# EAGLE design main (EAGLE 6.5.0)
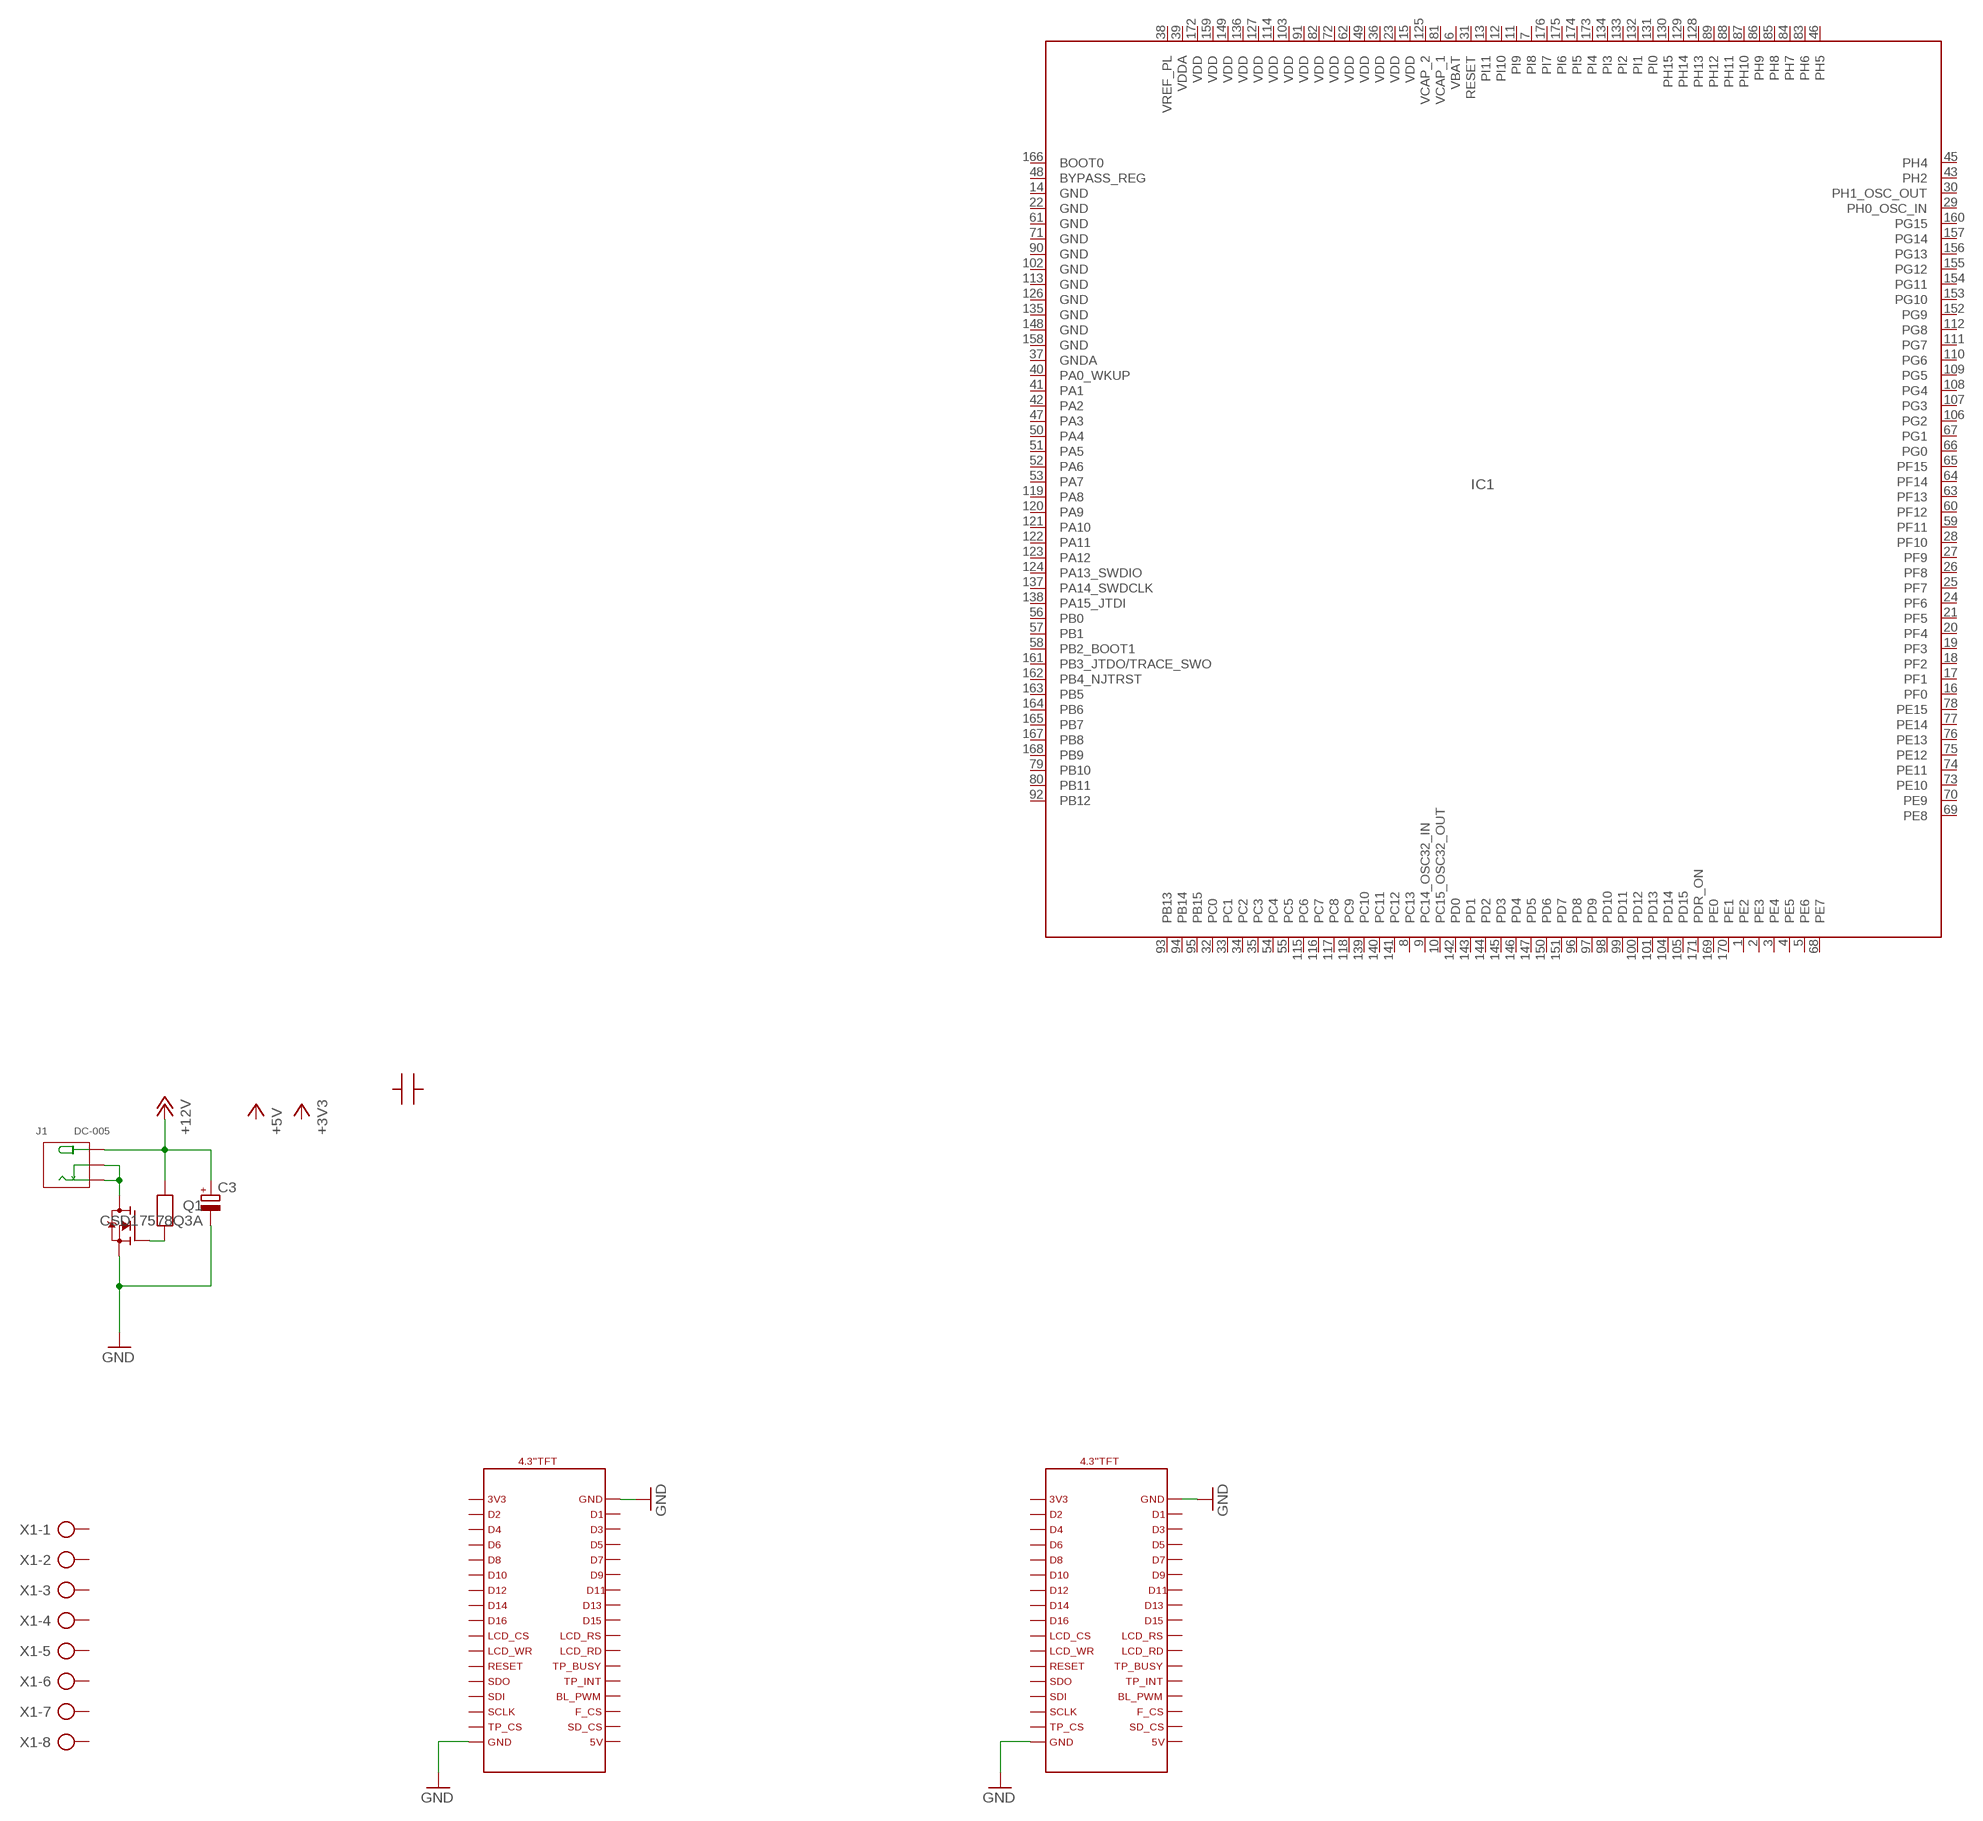
[diagram p0: schematic, sheet 1]

## Parts
C1  CAP0603  [C0603]
C3  CPOL-EU153CLV-0807  [153CLV-0807]
IC1  STM32F429IIT6  [LQFP176]
J1  DC-005  CONN-POWER-JACK-2.1MM(DC-005)  [DCJ3P-14.2X11.0X9.0MM]
Q1  CSD17578Q3A  [VSONP8]
R1  RES0603  [R0603]
U$1  4.3"TFT  [4.3TFT]
X1  AK500/8  [AK500/8]

## Nets
+12V: C3.+ J1.+ R1.1
GND: C3.- Q1.S1(S) Q1.S2(S) Q1.S3(S) U$1.JP1_1 U$1.JP1_34 U$1.JP2_1 U$1.JP2_34
N$1: Q1.G R1.2
N$2: J1.-1(-) J1.-2(CDN) Q1.D1(D) Q1.D2(D) Q1.D3(D) Q1.D4(D) Q1.D5(D)
Unconnected: C1.1 C1.2 IC1.1(PE2) IC1.2(PE3) IC1.3(PE4) IC1.4(PE5) IC1.5(PE6) IC1.7(PI8) IC1.8(PC13) IC1.9(PC14_OSC32_IN) IC1.10(PC15_OSC32_OUT) IC1.11(PI9) IC1.12(PI10) IC1.13(PI11) IC1.16(PF0) IC1.17(PF1) IC1.18(PF2) IC1.19(PF3) IC1.20(PF4) IC1.21(PF5) IC1.24(PF6) IC1.25(PF7) IC1.26(PF8) IC1.27(PF9) IC1.28(PF10) IC1.29(PH0_OSC_IN) IC1.30(PH1_OSC_OUT) IC1.31(RESET) IC1.32(PC0) IC1.33(PC1) IC1.34(PC2) IC1.35(PC3) IC1.40(PA0_WKUP) IC1.41(PA1) IC1.42(PA2) IC1.43(PH2) IC1.45(PH4) IC1.46(PH5) IC1.47(PA3) IC1.48(BYPASS_REG) IC1.50(PA4) IC1.51(PA5) IC1.52(PA6) IC1.53(PA7) IC1.54(PC4) IC1.55(PC5) IC1.56(PB0) IC1.57(PB1) IC1.58(PB2_BOOT1) IC1.59(PF11) IC1.60(PF12) IC1.63(PF13) IC1.64(PF14) IC1.65(PF15) IC1.66(PG0) IC1.67(PG1) IC1.68(PE7) IC1.69(PE8) IC1.70(PE9) IC1.73(PE10) IC1.74(PE11) IC1.75(PE12) IC1.76(PE13) IC1.77(PE14) IC1.78(PE15) IC1.79(PB10) IC1.80(PB11) IC1.83(PH6) IC1.84(PH7) IC1.85(PH8) IC1.86(PH9) IC1.87(PH10) IC1.88(PH11) IC1.89(PH12) IC1.92(PB12) IC1.93(PB13) IC1.94(PB14) IC1.95(PB15) IC1.96(PD8) IC1.97(PD9) IC1.98(PD10) IC1.99(PD11) IC1.100(PD12) IC1.101(PD13) IC1.104(PD14) IC1.105(PD15) IC1.106(PG2) IC1.107(PG3) IC1.108(PG4) IC1.109(PG5) IC1.110(PG6) IC1.111(PG7) IC1.112(PG8) IC1.115(PC6) IC1.116(PC7) IC1.117(PC8) IC1.118(PC9) IC1.119(PA8) IC1.120(PA9) IC1.121(PA10) IC1.122(PA11) IC1.123(PA12) IC1.124(PA13_SWDIO) IC1.128(PH13) IC1.129(PH14) IC1.130(PH15) IC1.131(PI0) IC1.132(PI1) IC1.133(PI2) IC1.134(PI3) IC1.137(PA14_SWDCLK) IC1.138(PA15_JTDI) IC1.139(PC10) IC1.140(PC11) IC1.141(PC12) IC1.142(PD0) IC1.143(PD1) IC1.144(PD2) IC1.145(PD3) IC1.146(PD4) IC1.147(PD5) IC1.150(PD6) IC1.151(PD7) IC1.152(PG9) IC1.153(PG10) IC1.154(PG11) IC1.155(PG12) IC1.156(PG13) IC1.157(PG14) IC1.160(PG15) IC1.161(PB3_JTDO/TRACE_SWO) IC1.162(PB4_NJTRST) IC1.163(PB5) IC1.164(PB6) IC1.165(PB7) IC1.166(BOOT0) IC1.167(PB8) IC1.168(PB9) IC1.169(PE0) IC1.170(PE1) IC1.173(PI4) IC1.174(PI5) IC1.175(PI6) IC1.176(PI7) U$1.JP1_2 U$1.JP1_3 U$1.JP1_4 U$1.JP1_5 U$1.JP1_6 U$1.JP1_7 U$1.JP1_8 U$1.JP1_9 U$1.JP1_10 U$1.JP1_11 U$1.JP1_12 U$1.JP1_13 U$1.JP1_14 U$1.JP1_15 U$1.JP1_16 U$1.JP1_17 U$1.JP1_18 U$1.JP1_19 U$1.JP1_20 U$1.JP1_21 U$1.JP1_22 U$1.JP1_23 U$1.JP1_24 U$1.JP1_25 U$1.JP1_26 U$1.JP1_27 U$1.JP1_28 U$1.JP1_29 U$1.JP1_30 U$1.JP1_31 U$1.JP1_32 U$1.JP1_33 U$1.JP2_2 U$1.JP2_3 U$1.JP2_4 U$1.JP2_5 U$1.JP2_6 U$1.JP2_7 U$1.JP2_8 U$1.JP2_9 U$1.JP2_10 U$1.JP2_11 U$1.JP2_12 U$1.JP2_13 U$1.JP2_14 U$1.JP2_15 U$1.JP2_16 U$1.JP2_17 U$1.JP2_18 U$1.JP2_19 U$1.JP2_20 U$1.JP2_21 U$1.JP2_22 U$1.JP2_23 U$1.JP2_24 U$1.JP2_25 U$1.JP2_26 U$1.JP2_27 U$1.JP2_28 U$1.JP2_29 U$1.JP2_30 U$1.JP2_31 U$1.JP2_32 U$1.JP2_33 X1.1 X1.2 X1.3 X1.4 X1.5 X1.6 X1.7 X1.8

## Power pins joined to a net without a drawn wire
GND: IC1.14(GND) IC1.22(GND) IC1.61(GND) IC1.71(GND) IC1.90(GND) IC1.102(GND) IC1.113(GND) IC1.126(GND) IC1.135(GND) IC1.148(GND) IC1.158(GND)
GNDA: IC1.37(GNDA)
PDR_ON: IC1.171(PDR_ON)
VBAT: IC1.6(VBAT)
VCAP_1: IC1.81(VCAP_1)
VCAP_2: IC1.125(VCAP_2)
VDD: IC1.15(VDD) IC1.23(VDD) IC1.36(VDD) IC1.49(VDD) IC1.62(VDD) IC1.72(VDD) IC1.82(VDD) IC1.91(VDD) IC1.103(VDD) IC1.114(VDD) IC1.127(VDD) IC1.136(VDD) IC1.149(VDD) IC1.159(VDD) IC1.172(VDD)
VDDA: IC1.39(VDDA)
VREF_PL: IC1.38(VREF_PL)

## Library data of the parts
C1 = My_RLC:CAP0603: Ceramic Capasitor SMD 0603
C3 = rcl:CPOL-EU: POLARIZED CAPACITOR, European symbol
IC1 = MyST:STM32F429IIT6: STM32F429II ARM Cortex-M4 32b MCU+FPU, 225DMIPS, up to 2MB Flash/256+4KB RAM, USB OTG HS/FS, Ethernet, 17 TIMs, 3 ADCs, 20 comm. interfaces, camera & LCD-TFT Datasheet <http://www.st.com/st-web-ui/static/active/en/resource/technical/document/datasheet/DM00071990.pdf>
J1 = Seeed-OPL-Connector:CONN-POWER-JACK-2.1MM(DC-005): 320120003; MPN: DC-005
Q1 = Mosfet_Logic:CSD17578Q3A: 30 V N-Channel NexFET™ Power MOSFETs. 14/142A
R1 = My_RLC:RES0603: Resistor SMD 0603
U$1 = Displays:4.3"TFT: 4.3 inch TFT LCD 480x272 Pix with resistiv touch panel
X1 = con-ptr500:AK500/8: CONNECTOR; OC_FARNELL: unknown; OC_NEWARK: unknown

## Board
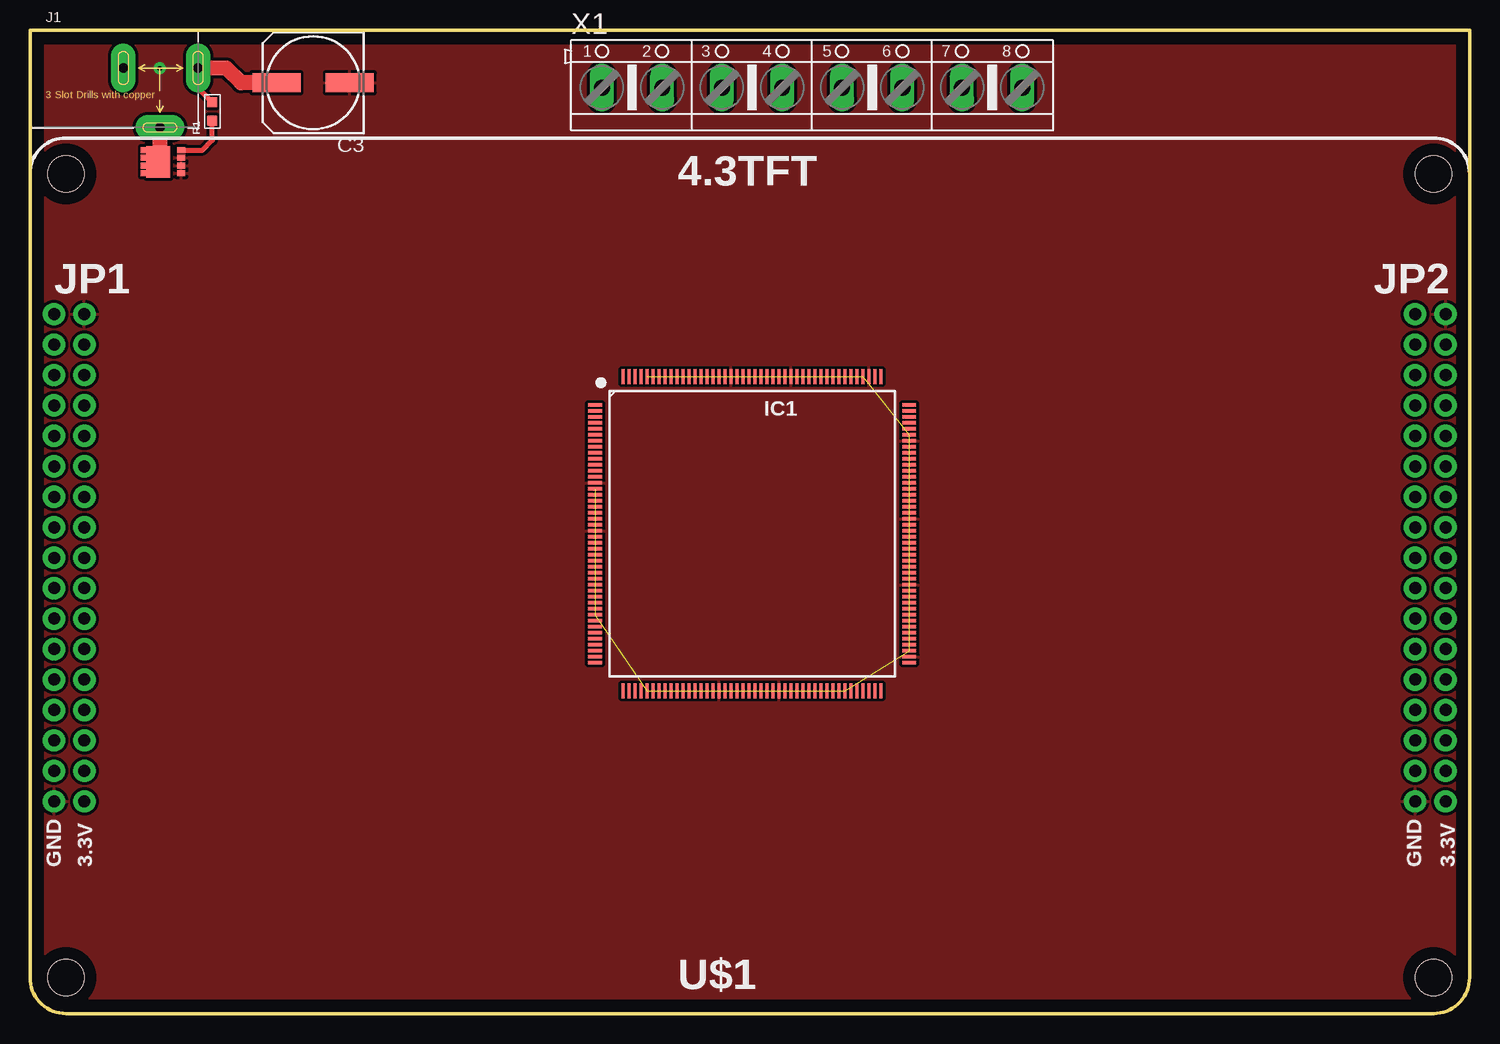
[diagram p1: board, top side]
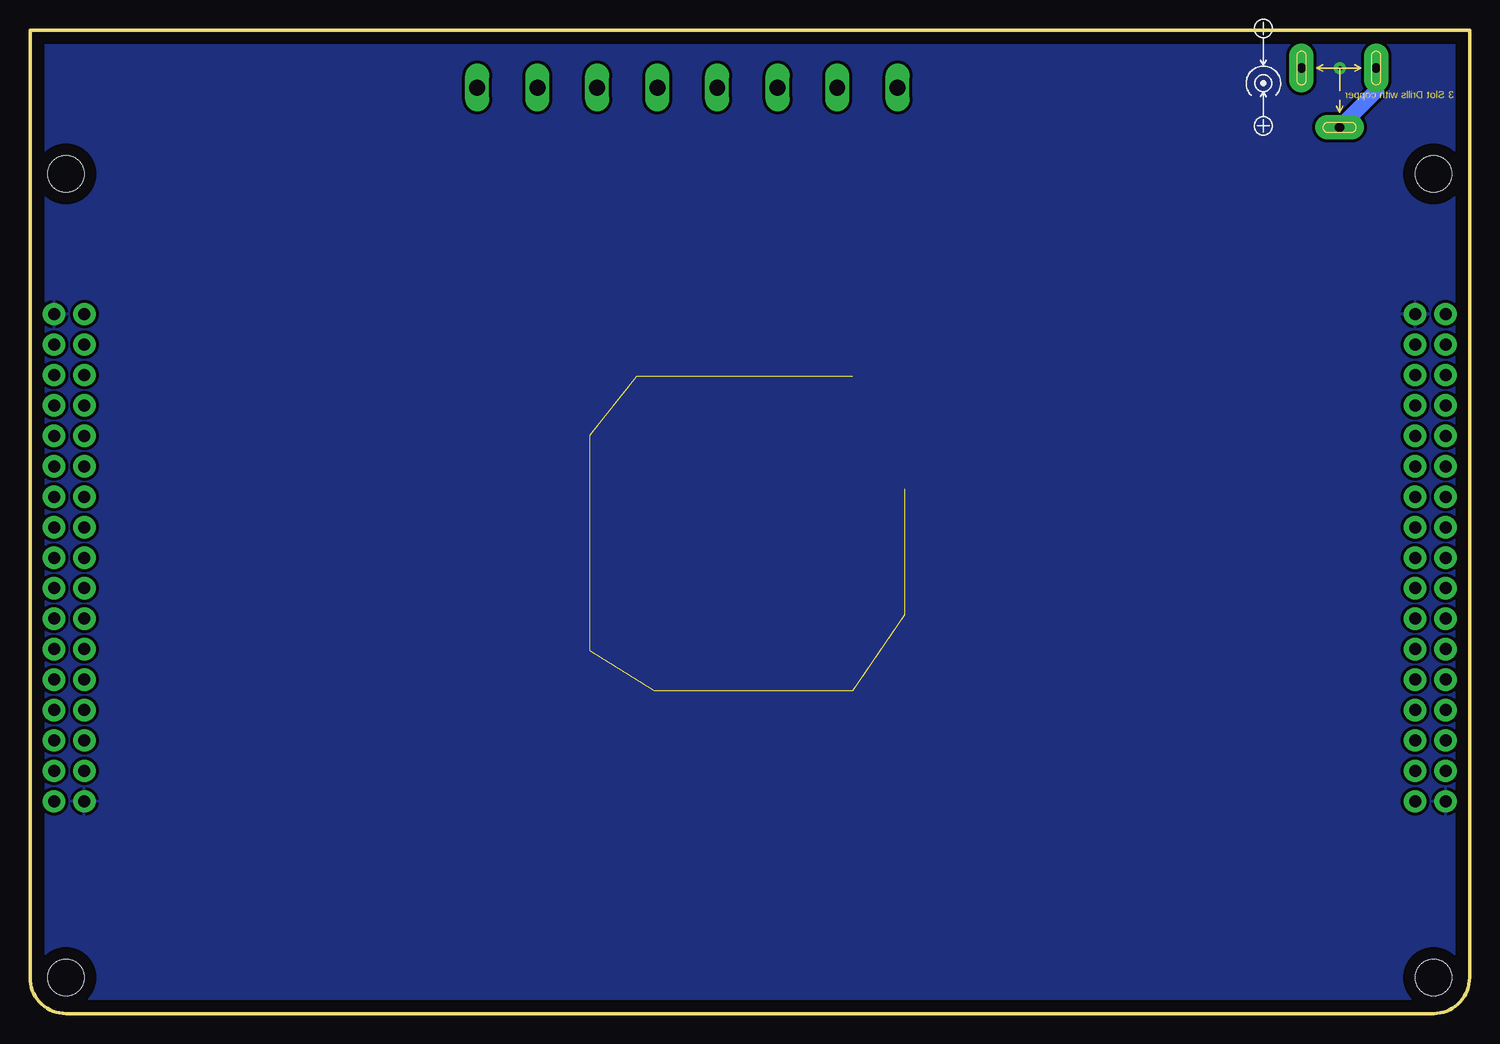
[diagram p2: board, bottom side, seen from below]

Size 120 x 82 mm. Coordinates in mm from the lower left corner, seen from the top.
Outline: 0,3 0,82 120,82 120,3 arc-90 117,0 3,0 arc-90 0,3
Copper layers (1*16): Top 0.035mm / dielectric 1.5mm / Bottom 0.035mm
Design rules "default": minimum track width 10mil, minimum drill 24mil, track to track 8mil, track to pad 8mil, pad to pad 8mil, via to via 8mil, smd to smd 8mil, copper to edge 40mil, drill to drill 8mil, minimum pad ring 10mil, minimum via ring 8mil, stop-mask expansion 4mil, vias tented up to drill 0mil, thermal gap 10mil

### Footprints (pad centres in the part's own frame; a part is rotated, then mirrored left to right if it is on the bottom)
C0603 = smd 0.889 x 0.889: 1 0,0.762; 2 0,-0.762
153CLV-0807 = smd 4 x 1.6: + 3.05,0; - -3.05,0
LQFP176 = smd 1.2 x 0.3: 1 -13.1,10.75; 2 -13.1,10.25; 3 -13.1,9.75; 4 -13.1,9.25; 5 -13.1,8.75; 6 -13.1,8.25; 7 -13.1,7.75; 8 -13.1,7.25; 9 -13.1,6.75; 10 -13.1,6.25; 11 -13.1,5.75; 12 -13.1,5.25; 13 -13.1,4.75; 14 -13.1,4.25; 15 -13.1,3.75; 16 -13.1,3.25; 17 -13.1,2.75; 18 -13.1,2.25; 19 -13.1,1.75; 20 -13.1,1.25; 21 -13.1,0.75; 22 -13.1,0.25; 23 -13.1,-0.25; 24 -13.1,-0.75; 25 -13.1,-1.25; 26 -13.1,-1.75; 27 -13.1,-2.25; 28 -13.1,-2.75; 29 -13.1,-3.25; 30 -13.1,-3.75; 31 -13.1,-4.25; 32 -13.1,-4.75; 33 -13.1,-5.25; 34 -13.1,-5.75; 35 -13.1,-6.25; 36 -13.1,-6.75; 37 -13.1,-7.25; 38 -13.1,-7.75; 39 -13.1,-8.25; 40 -13.1,-8.75; 41 -13.1,-9.25; 42 -13.1,-9.75; 43 -13.1,-10.25; 44 -13.1,-10.75; 89 13.1,-10.75; 90 13.1,-10.25; 91 13.1,-9.75; 92 13.1,-9.25; 93 13.1,-8.75; 94 13.1,-8.25; 95 13.1,-7.75; 96 13.1,-7.25; 97 13.1,-6.75; 98 13.1,-6.25; 99 13.1,-5.75; 100 13.1,-5.25; 101 13.1,-4.75; 102 13.1,-4.25; 103 13.1,-3.75; 104 13.1,-3.25; 105 13.1,-2.75; 106 13.1,-2.25; 107 13.1,-1.75; 108 13.1,-1.25; 109 13.1,-0.75; 110 13.1,-0.25; 111 13.1,0.25; 112 13.1,0.75; 113 13.1,1.25; 114 13.1,1.75; 115 13.1,2.25; 116 13.1,2.75; 117 13.1,3.25; 118 13.1,3.75; 119 13.1,4.25; 120 13.1,4.75; 121 13.1,5.25; 122 13.1,5.75; 123 13.1,6.25; 124 13.1,6.75; 125 13.1,7.25; 126 13.1,7.75; 127 13.1,8.25; 128 13.1,8.75; 129 13.1,9.25; 130 13.1,9.75; 131 13.1,10.25; 132 13.1,10.75 | smd 0.3 x 1.2: 45 -10.75,-13.1; 46 -10.25,-13.1; 47 -9.75,-13.1; 48 -9.25,-13.1; 49 -8.75,-13.1; 50 -8.25,-13.1; 51 -7.75,-13.1; 52 -7.25,-13.1; 53 -6.75,-13.1; 54 -6.25,-13.1; 55 -5.75,-13.1; 56 -5.25,-13.1; 57 -4.75,-13.1; 58 -4.25,-13.1; 59 -3.75,-13.1; 60 -3.25,-13.1; 61 -2.75,-13.1; 62 -2.25,-13.1; 63 -1.75,-13.1; 64 -1.25,-13.1; 65 -0.75,-13.1; 66 -0.25,-13.1; 67 0.25,-13.1; 68 0.75,-13.1; 69 1.25,-13.1; 70 1.75,-13.1; 71 2.25,-13.1; 72 2.75,-13.1; 73 3.25,-13.1; 74 3.75,-13.1; 75 4.25,-13.1; 76 4.75,-13.1; 77 5.25,-13.1; 78 5.75,-13.1; 79 6.25,-13.1; 80 6.75,-13.1; 81 7.25,-13.1; 82 7.75,-13.1; 83 8.25,-13.1; 84 8.75,-13.1; 85 9.25,-13.1; 86 9.75,-13.1; 87 10.25,-13.1; 88 10.75,-13.1; 133 10.75,13.1; 134 10.25,13.1; 135 9.75,13.1; 136 9.25,13.1; 137 8.75,13.1; 138 8.25,13.1; 139 7.75,13.1; 140 7.25,13.1; 141 6.75,13.1; 142 6.25,13.1; 143 5.75,13.1; 144 5.25,13.1; 145 4.75,13.1; 146 4.25,13.1; 147 3.75,13.1; 148 3.25,13.1; 149 2.75,13.1; 150 2.25,13.1; 151 1.75,13.1; 152 1.25,13.1; 153 0.75,13.1; 154 0.25,13.1; 155 -0.25,13.1; 156 -0.75,13.1; 157 -1.25,13.1; 158 -1.75,13.1; 159 -2.25,13.1; 160 -2.75,13.1; 161 -3.25,13.1; 162 -3.75,13.1; 163 -4.25,13.1; 164 -4.75,13.1; 165 -5.25,13.1; 166 -5.75,13.1; 167 -6.25,13.1; 168 -6.75,13.1; 169 -7.25,13.1; 170 -7.75,13.1; 171 -8.25,13.1; 172 -8.75,13.1; 173 -9.25,13.1; 174 -9.75,13.1; 175 -10.25,13.1; 176 -10.75,13.1
DCJ3P-14.2X11.0X9.0MM = drill 0.813 pad 2.032 long: + 3.175,0; -1 -3.048,0; -2 0,-4.953
VSONP8 = smd 2.65 x 2.01: D1 -1,1.9 | smd 0.5 x 0.68: D2 0,3.03; D3 -0.65,3.03; D4 -1.3,3.03; D5 -1.95,3.03; G 0,0; S1 -1.95,0; S2 -1.3,0; S3 -0.65,0
R0603 = smd 0.889 x 0.889: 1 0,0.762; 2 0,-0.762
4.3TFT = drill 1 pad 1.85: JP1_1 2,17.68; JP1_2 4.54,17.68; JP1_3 2,20.22; JP1_4 4.54,20.22; JP1_5 2,22.76; JP1_6 4.54,22.76; JP1_7 2,25.3; JP1_8 4.54,25.3; JP1_9 2,27.84; JP1_10 4.54,27.84; JP1_11 2,30.38; JP1_12 4.54,30.38; JP1_13 2,32.92; JP1_14 4.54,32.92; JP1_15 2,35.46; JP1_16 4.54,35.46; JP1_17 2,38; JP1_18 4.54,38; JP1_19 2,40.54; JP1_20 4.54,40.54; JP1_21 2,43.08; JP1_22 4.54,43.08; JP1_23 2,45.62; JP1_24 4.54,45.62; JP1_25 2,48.16; JP1_26 4.54,48.16; JP1_27 2,50.7; JP1_28 4.54,50.7; JP1_29 2,53.24; JP1_30 4.54,53.24; JP1_31 2,55.78; JP1_32 4.54,55.78; JP1_33 2,58.32; JP1_34 4.54,58.32; JP2_1 115.46,17.68; JP2_2 118,17.68; JP2_3 115.46,20.22; JP2_4 118,20.22; JP2_5 115.46,22.76; JP2_6 118,22.76; JP2_7 115.46,25.3; JP2_8 118,25.3; JP2_9 115.46,27.84; JP2_10 118,27.84; JP2_11 115.46,30.38; JP2_12 118,30.38; JP2_13 115.46,32.92; JP2_14 118,32.92; JP2_15 115.46,35.46; JP2_16 118,35.46; JP2_17 115.46,38; JP2_18 118,38; JP2_19 115.46,40.54; JP2_20 118,40.54; JP2_21 115.46,43.08; JP2_22 118,43.08; JP2_23 115.46,45.62; JP2_24 118,45.62; JP2_25 115.46,48.16; JP2_26 118,48.16; JP2_27 115.46,50.7; JP2_28 118,50.7; JP2_29 115.46,53.24; JP2_30 118,53.24; JP2_31 115.46,55.78; JP2_32 118,55.78; JP2_33 115.46,58.32; JP2_34 118,58.32 | hole 3: 3,70; 3,3; 117,3; 117,70
AK500/8 = drill 1.321 long: 1 -17.526,0; 2 -12.497,0; 3 -7.518,0; 4 -2.489,0; 5 2.489,0; 6 7.518,0; 7 12.497,0; 8 17.526,0

### Placement (x,y rotation side)
C1  -5.8,1 0 top  (outside the outline)
C3  23.6,77.6 180 top
IC1  60.2,40 0 top
J1  10.83,78.83 0 top
Q1  12.6,72 90 top
R1  15.2,75.2 0 top
U$1  0,0 0 top
X1  65.2,77.2 0 top

### Tracks (layer width: path | path; a pad name or v marks a point on that pad's centre or on a via)
+12V
  Top 0.406: J1.+ 14.01,77.16 R1.1
  Top 1.27: C3.+ 17.6,77.6 16.37,78.83 J1.+
GND  (via drill 0.4 pad 1.02)
  other vias: 10.8,78.8
  pour Top (isolate 0.25): 0,82 120,82 120,0 0,0
  pour Bottom (isolate 0.25): 120,82 0,82 0,0 120,0
N$1
  Top 0.406: Q1.G 14.4,72 15.2,72.8 R1.2
N$2
  Top 0.406: Q1.D2 10.83,72 | Q1.D3 10.35,71.35 Q1.D1 | Q1.D4 10.4,70.7 Q1.D1 | Q1.D5 10.45,70.05 10.6,70.2 10.6,70.9 Q1.D1
  Top 1.27: J1.-2 10.83,72 10.83,71.13 Q1.D1
  Bottom 1.27: J1.-1 7.78,76.92 J1.-2
VDD  (14 unrouted)